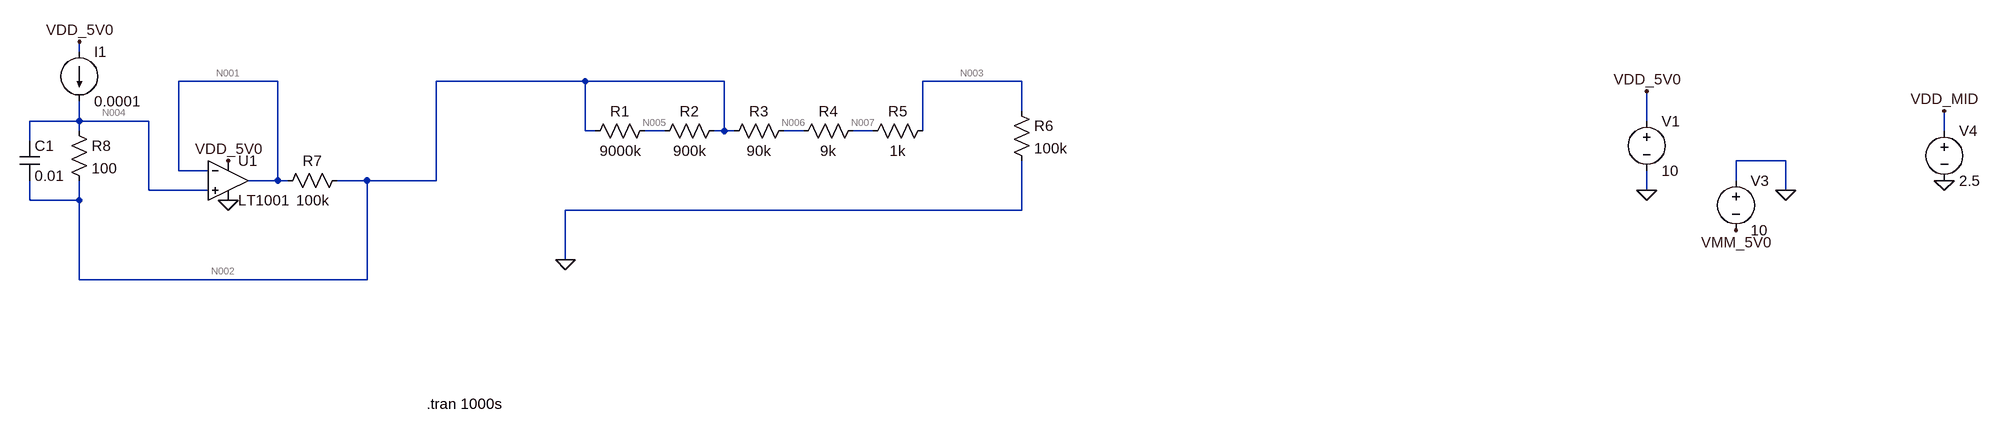
[diagram p0: schematic front_end_ohms.asc]
front_end_ohms.asc, the LTspice schematic file:
Version 4
SHEET 1 2288 680
WIRE -784 -352 -784 -368
WIRE -464 -304 -624 -304
WIRE 32 -304 -208 -304
WIRE 256 -304 32 -304
WIRE 736 -304 576 -304
WIRE 736 -256 736 -304
WIRE -784 -240 -784 -272
WIRE -784 -240 -864 -240
WIRE -672 -240 -784 -240
WIRE 1744 -240 1744 -288
WIRE -784 -224 -784 -240
WIRE 32 -224 32 -304
WIRE 48 -224 32 -224
WIRE 160 -224 128 -224
WIRE 256 -224 256 -304
WIRE 256 -224 240 -224
WIRE 272 -224 256 -224
WIRE 384 -224 352 -224
WIRE 496 -224 464 -224
WIRE 576 -224 576 -304
WIRE 2224 -224 2224 -256
WIRE -864 -208 -864 -240
WIRE 1968 -176 1888 -176
WIRE -624 -160 -624 -304
WIRE -576 -160 -624 -160
WIRE -464 -144 -464 -304
WIRE -464 -144 -512 -144
WIRE -448 -144 -464 -144
WIRE -320 -144 -368 -144
WIRE -208 -144 -208 -304
WIRE -208 -144 -320 -144
WIRE 1888 -144 1888 -176
WIRE -672 -128 -672 -240
WIRE -576 -128 -672 -128
WIRE 1744 -128 1744 -160
WIRE 1968 -128 1968 -176
WIRE -864 -112 -864 -144
WIRE -784 -112 -784 -144
WIRE -784 -112 -864 -112
WIRE 736 -96 736 -176
WIRE 736 -96 0 -96
WIRE 0 -16 0 -96
WIRE -784 16 -784 -112
WIRE -320 16 -320 -144
WIRE -320 16 -784 16
FLAG 0 -16 0
FLAG 1744 -288 VDD_5V0
FLAG 1744 -128 0
FLAG 1968 -128 0
FLAG 1888 -64 VMM_5V0
FLAG 2224 -256 VDD_MID
FLAG 2224 -144 0
FLAG -544 -112 0
FLAG -544 -176 VDD_5V0
FLAG -784 -368 VDD_5V0
SYMBOL voltage 1744 -256 R0
WINDOW 123 0 0 Left 0
WINDOW 39 0 0 Left 0
SYMATTR InstName V1
SYMATTR Value 10
SYMBOL voltage 1888 -160 R0
WINDOW 123 0 0 Left 0
WINDOW 39 0 0 Left 0
SYMATTR InstName V3
SYMATTR Value 10
SYMBOL voltage 2224 -240 R0
WINDOW 123 0 0 Left 0
WINDOW 39 0 0 Left 0
SYMATTR InstName V4
SYMATTR Value 2.5
SYMBOL res 720 -272 R0
SYMATTR InstName R6
SYMATTR Value 100k
SYMBOL current -784 -352 R0
WINDOW 123 0 0 Left 0
WINDOW 39 0 0 Left 0
SYMATTR InstName I1
SYMATTR Value 0.0001
SYMBOL res -352 -160 R90
WINDOW 0 0 56 VBottom 2
WINDOW 3 32 56 VTop 2
SYMATTR InstName R7
SYMATTR Value 100k
SYMBOL res -800 -240 R0
SYMATTR InstName R8
SYMATTR Value 100
SYMBOL cap -880 -208 R0
SYMATTR InstName C1
SYMATTR Value 0.01
SYMBOL Opamps\\LT1001 -544 -208 R0
SYMATTR InstName U1
SYMBOL res 144 -240 R90
WINDOW 0 0 56 VBottom 2
WINDOW 3 32 56 VTop 2
SYMATTR InstName R1
SYMATTR Value 9000k
SYMBOL res 256 -240 R90
WINDOW 0 0 56 VBottom 2
WINDOW 3 32 56 VTop 2
SYMATTR InstName R2
SYMATTR Value 900k
SYMBOL res 368 -240 R90
WINDOW 0 0 56 VBottom 2
WINDOW 3 32 56 VTop 2
SYMATTR InstName R3
SYMATTR Value 90k
SYMBOL res 480 -240 R90
WINDOW 0 0 56 VBottom 2
WINDOW 3 32 56 VTop 2
SYMATTR InstName R4
SYMATTR Value 9k
SYMBOL res 592 -240 R90
WINDOW 0 0 56 VBottom 2
WINDOW 3 32 56 VTop 2
SYMATTR InstName R5
SYMATTR Value 1k
TEXT -224 216 Left 2 !.tran 1000s

The netlist it stands for:
* front_end_ohms.asc
V1 VDD_5V0 0 10
V3 0 VMM_5V0 10
V4 VDD_MID 0 2.5
R6 N003 0 100k
I1 VDD_5V0 N004 0.0001
R7 N002 N001 100k
R8 N004 N002 100
C1 N004 N002 0.01
XU1 N004 N001 VDD_5V0 0 N001 LT1001  ; pins In+ In- V+ V- OUT
R1 N005 N002 9000k
R2 N002 N005 900k
R3 N006 N002 90k
R4 N007 N006 9k
R5 N003 N007 1k
.tran 1000s
.lib LTC.lib
.backanno
.end

* Results of the author's LTspice run, read from the files saved beside the schematic
* Operating Point, zero values left out:
*   V(vdd_5v0) = 10 V
*   V(vmm_5v0) = -10 V
*   V(vdd_mid) = 2.5 V
*   V(n003) = 5.176 V
*   V(n004) = 10.36 V
*   V(n002) = 10.35 V
*   V(n001) = 9.072 V
*   V(n005) = 10.35 V
*   V(n006) = 5.693 V
*   V(n007) = 5.227 V
*   I(I1) = 100 µA
*   I(R5) = -51.76 µA
*   I(R4) = -51.76 µA
*   I(R3) = -51.76 µA
*   I(R8) = 64.55 µA
*   I(R7) = 12.79 µA
*   I(R6) = 51.76 µA
*   I(V1) = -2.323 mA
*   Ix(u1:1) = 35.45 µA
*   Ix(u1:2) = -35.45 µA
*   Ix(u1:3) = 2.223 mA
*   Ix(u1:4) = -2.278 mA
*   Ix(u1:5) = 48.24 µA